# Altium schematic sheet Main.SchDoc
size A; SheetNumber: 1; SheetTotal: 1
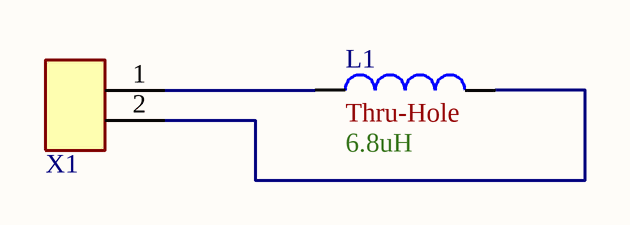
[diagram p0: Main.SchDoc]

## Parts
L1  Package: Thru-Hole  Inductance: 6.8uH  [[6.8uH] Thru-Hole 47.5A 1.2mOhm]  (hidden comment: [6.8uH] Thru-Hole 47.5A 1.2mOhm)
X1  2pin Screw Terminal  [[Screw Terminal] 2pin 5mm]  (value not drawn)

## Nets
NetL1_1: L1.1 X1.1
NetL1_2: L1.2 X1.2

## Library data of the parts
L1 = [6.8uH] Thru-Hole 47.5A 1.2mOhm: B82559A5682A033; Supplier 1: DigiKey; Supplier Part Number 1: 495-B82559A5682A033-ND
X1 = [Screw Terminal] 2pin: TB002-500-02BE; Supplier 1: DigiKey; Supplier Part Number 1: 102-6145-ND